# EAGLE design Capacitive-Touch-PCB (EAGLE 9.4.2)
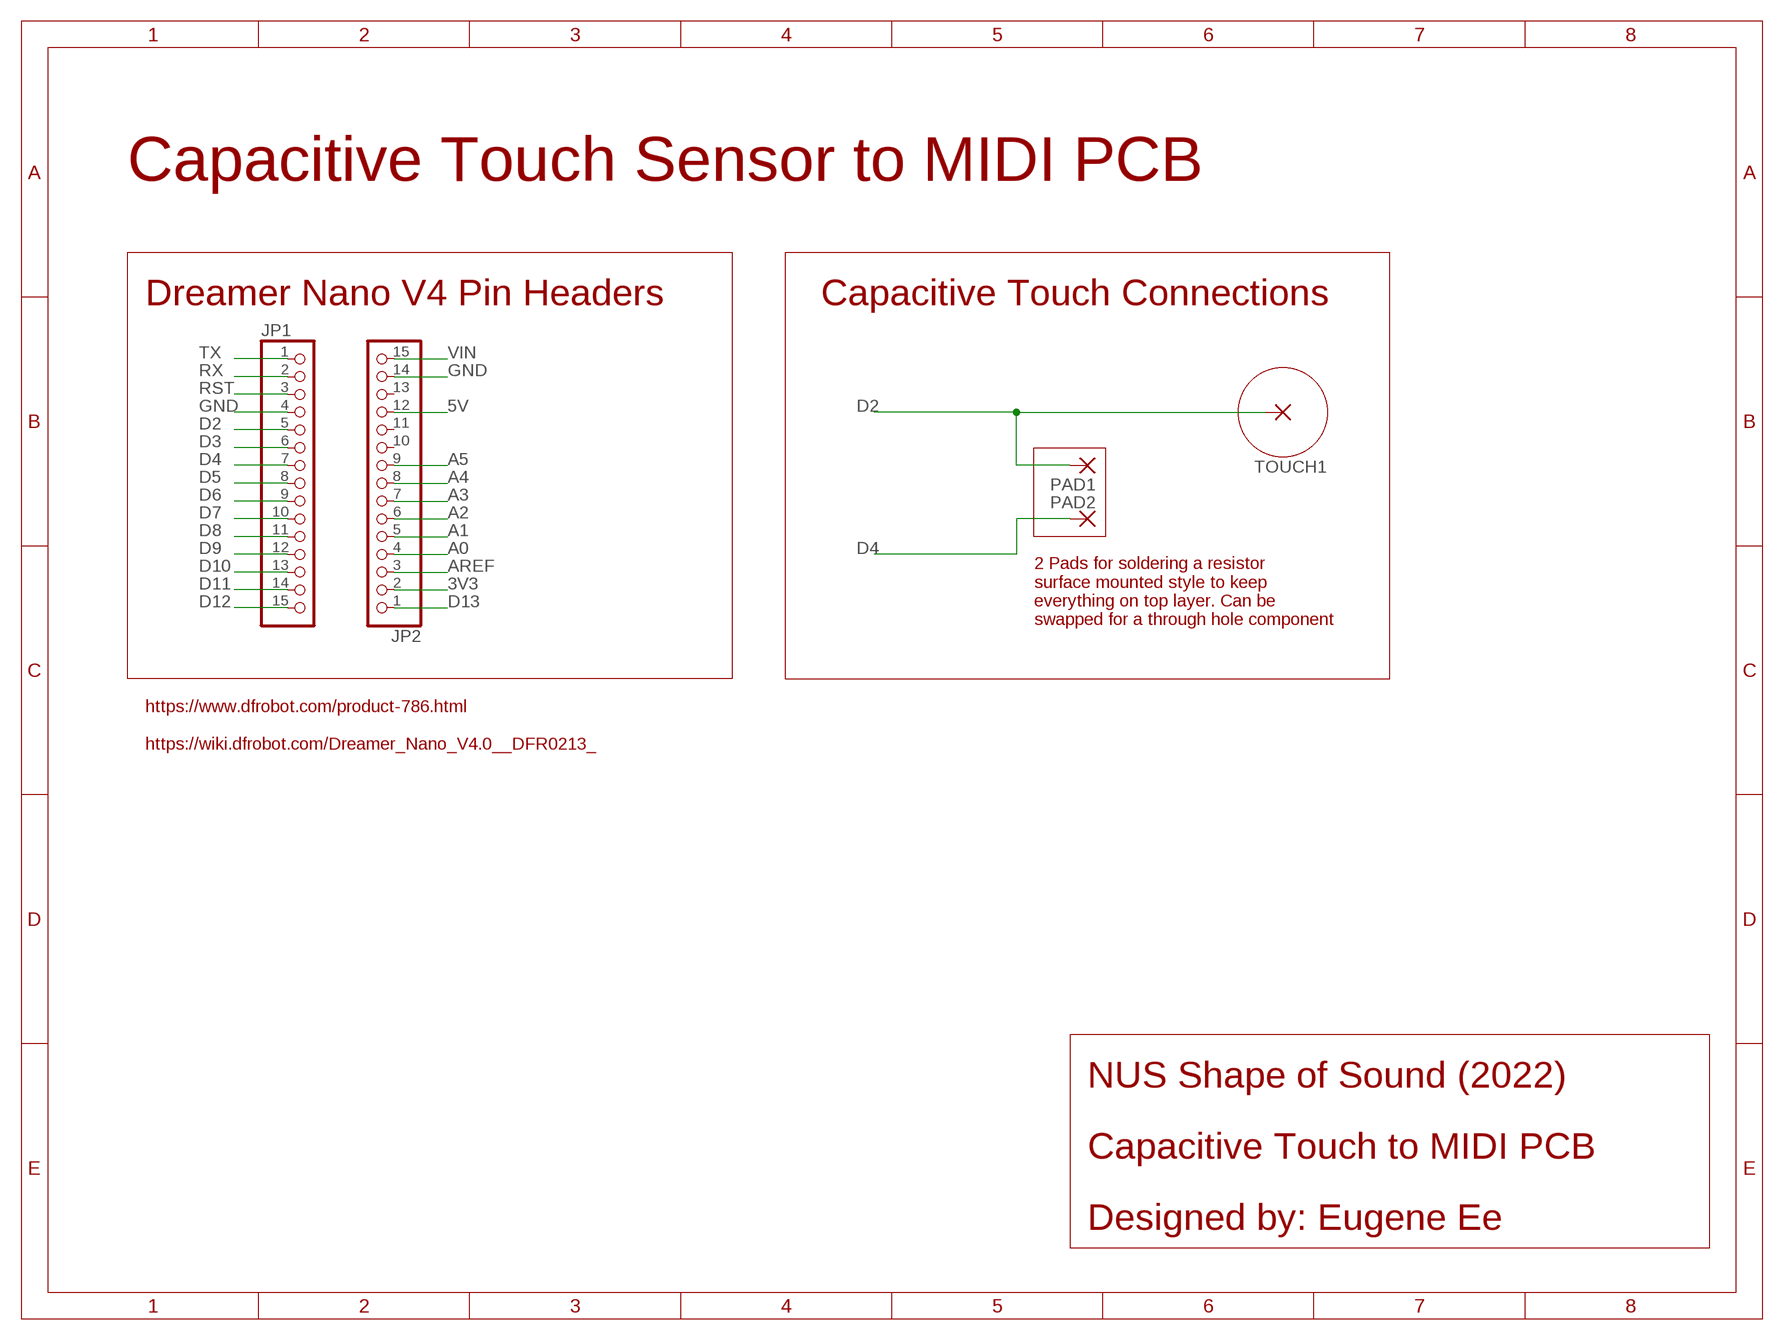
[diagram p0: schematic, sheet 1]

## Parts
JP1  PINHD-1X15  [1X15]
JP2  PINHD-1X15  [1X15]
PAD1  SMD5  [SMD2,54-5,08]
PAD2  SMD5  [SMD2,54-5,08]
TOUCH1  SMD5  [SMD2,54-5,08]

## Nets
3V3: JP2.2
5V: JP2.12
A0: JP2.4
A1: JP2.5
A2: JP2.6
A3: JP2.7
A4: JP2.8
A5: JP2.9
AREF: JP2.3
D2: JP1.5 PAD1.1(P) TOUCH1.1(P)
D3: JP1.6
D4: JP1.7 PAD2.1(P)
D5: JP1.8
D6: JP1.9
D7: JP1.10
D8: JP1.11
D9: JP1.12
D10: JP1.13
D11: JP1.14
D12: JP1.15
D13: JP2.1
GND: JP1.4 JP2.14
RST: JP1.3
RX: JP1.2
TX: JP1.1
VIN: JP2.15
Unconnected: JP2.10 JP2.11 JP2.13

## Notes on the sheet
- Capacitive Touch Sensor to MIDI PCB
- Dreamer Nano V4 Pin Headers | Capacitive Touch Connections
- 2 Pads for soldering a resistor
  surface mounted style to keep
  everything on top layer. Can be
  swapped for a through hole component
- https://www.dfrobot.com/product-786.html
  
  https://wiki.dfrobot.com/Dreamer_Nano_V4.0__DFR0213_
- NUS Shape of Sound (2022)
- Capacitive Touch to MIDI PCB
- Designed by: Eugene Ee

## Library data of the parts
JP1 JP2 = pinhead:PINHD-1X15: PIN HEADER
PAD1 PAD2 TOUCH1 = wirepad:SMD5: SMD PAD

## Net classes
1 USB: width 0.203 mm, drill 0.406 mm, clearance 0.203 mm
3 usbvcc: width 0.203 mm, drill 0.406 mm, clearance 0.203 mm
4 USBpair: width 0.254 mm, drill 0.406 mm, clearance 0.61 mm

## Board
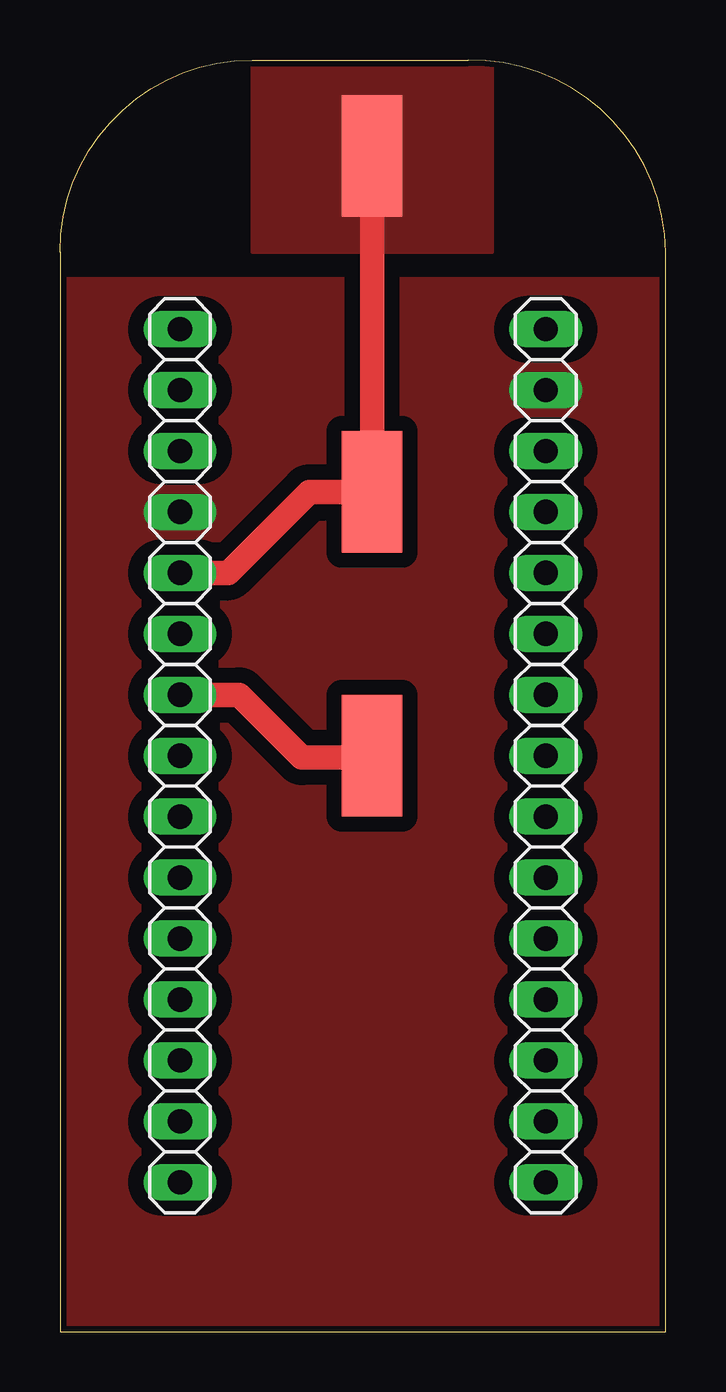
[diagram p1: board, top side]

Size 25.24 x 53 mm. Coordinates in mm from the lower left corner, seen from the top.
Outline: 0,0 25.24,0 25.24,45 arc90 17,53 8,53 arc90 0,45 0,0
Copper layers (1*16): Top 0.035mm / dielectric 1.5mm / Bottom 0.035mm
Design rules "SeeedStudio_2layer_DRU_no_angle_20140221 *": minimum track width 6mil, minimum drill 12mil, track to track 25mil, track to pad 35mil, pad to pad 25mil, via to via 6mil, smd to smd 0mil, copper to edge 10mil, drill to drill 10mil, minimum pad ring 10mil, minimum via ring 6mil, stop-mask expansion 2mil, vias tented up to drill 100mil, thermal gap 10mil

### Footprints (pad centres in the part's own frame; a part is rotated, then mirrored left to right if it is on the bottom)
1X15 = drill 1.016 long: 1 -17.78,0; 2 -15.24,0; 3 -12.7,0; 4 -10.16,0; 5 -7.62,0; 6 -5.08,0; 7 -2.54,0; 8 0,0; 9 2.54,0; 10 5.08,0; 11 7.62,0; 12 10.16,0; 13 12.7,0; 14 15.24,0; 15 17.78,0
SMD2,54-5,08 = smd 2.54 x 5.08: 1 0,0

### Placement (x,y rotation side)
JP1  5,24 270 top
JP2  20.24,24 90 top
PAD1  13,35 180 top
PAD2  13,24 0 top
TOUCH1  13,49 180 top

### Tracks (layer width: path | path; a pad name or v marks a point on that pad's centre or on a via)
D2
  Top 1.016: JP1.5 7,31.62 10.38,35 PAD1.1 TOUCH1.1
  pour Top (no thermals): 8,45 18,45 18,53 8,53
D4
  Top 1.016: JP1.7 7.46,26.54 10.08,23.92 12.92,23.92 PAD2.1
GND
  pour Top (no thermals): 25.24,0 25.24,43.75 0,43.75 0,0